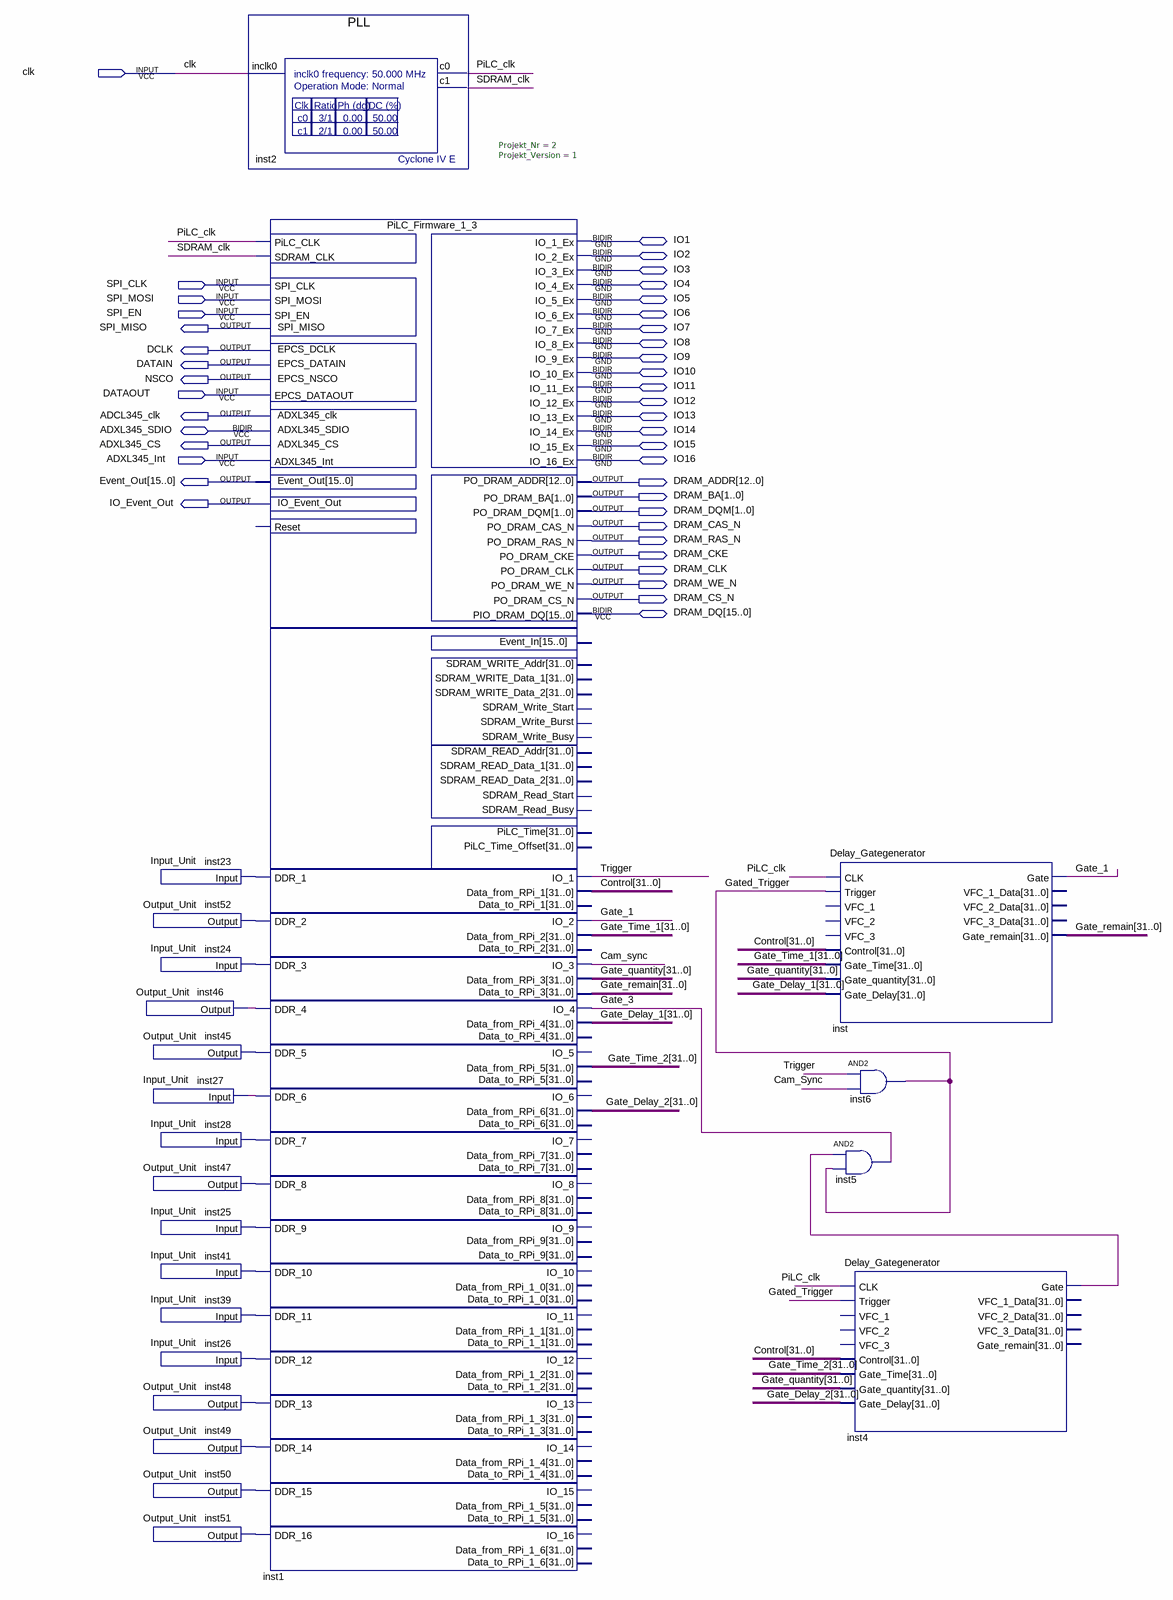
[diagram p0: schematic sheet]
// Quartus schematic PILC.bdf as structural Verilog: 22 symbols, 41 pins
module PILC (
  input  clk,
  input  SPI_CLK,
  input  SPI_MOSI,
  input  SPI_EN,
  input  DATAOUT,
  input  ADXL345_Int,
  inout  IO1,
  inout  IO2,
  inout  IO3,
  inout  IO4,
  inout  IO5,
  inout  IO6,
  inout  IO7,
  inout  IO8,
  inout  IO9,
  inout  IO10,
  inout  IO11,
  inout  IO12,
  inout  IO13,
  inout  ADXL345_SDIO,
  inout  IO14,
  inout  IO15,
  inout  IO16,
  inout  [15:0] DRAM_DQ,
  output SPI_MISO,
  output DCLK,
  output DATAIN,
  output NSCO,
  output ADCL345_clk,
  output ADXL345_CS,
  output [15:0] Event_Out,
  output [12:0] DRAM_ADDR,
  output [1:0] DRAM_BA,
  output IO_Event_Out,
  output [1:0] DRAM_DQM,
  output DRAM_CAS_N,
  output DRAM_RAS_N,
  output DRAM_CKE,
  output DRAM_CLK,
  output DRAM_WE_N,
  output DRAM_CS_N
);

  wire Cam_sync, Gate_1, Gate_3, Gated_Trigger, inst4_gate, inst23_input, inst24_input, inst25_input,
       inst26_input, inst27_input, inst28_input, inst39_input, inst41_input, inst45_output, inst46_output,
       inst47_output, inst48_output, inst49_output, inst50_output, inst51_output, inst52_output, PiLC_clk,
       SDRAM_clk, Trigger;
  wire [31:0] Control, Gate_Delay_1, Gate_Delay_2, Gate_quantity, Gate_remain, Gate_Time_1, Gate_Time_2;

  Input_Unit inst23 (.Input(inst23_input));
  Output_Unit inst52 (.Output(inst52_output));
  Input_Unit inst24 (.Input(inst24_input));
  Output_Unit inst46 (.Output(inst46_output));
  Output_Unit inst45 (.Output(inst45_output));
  Input_Unit inst27 (.Input(inst27_input));
  Input_Unit inst28 (.Input(inst28_input));
  Output_Unit inst47 (.Output(inst47_output));
  Input_Unit inst25 (.Input(inst25_input));
  Input_Unit inst41 (.Input(inst41_input));
  Input_Unit inst39 (.Input(inst39_input));
  Input_Unit inst26 (.Input(inst26_input));
  Output_Unit inst48 (.Output(inst48_output));
  Output_Unit inst49 (.Output(inst49_output));
  Output_Unit inst50 (.Output(inst50_output));
  Output_Unit inst51 (.Output(inst51_output));
  PLL inst2 (.inclk0(clk), .c0(PiLC_clk), .c1(SDRAM_clk));
  PiLC_Firmware_1_3 #(.Projekt_Nr(2), .Projekt_Version(1)) inst1 (
    .PiLC_CLK(PiLC_clk), .SDRAM_CLK(SDRAM_clk), .SPI_CLK(SPI_CLK), .SPI_MOSI(SPI_MOSI), .SPI_EN(SPI_EN),
    .EPCS_DATAOUT(DATAOUT), .DDR_1(inst23_input), .DDR_2(inst52_output), .DDR_3(inst24_input),
    .Data_to_RPi_3(Gate_remain), .DDR_4(inst46_output), .DDR_5(inst45_output), .DDR_6(inst27_input),
    .DDR_7(inst28_input), .DDR_8(inst47_output), .DDR_9(inst25_input), .DDR_10(inst41_input),
    .DDR_11(inst39_input), .DDR_12(inst26_input), .DDR_13(inst48_output), .DDR_14(inst49_output),
    .DDR_15(inst50_output), .DDR_16(inst51_output), .ADXL345_Int(ADXL345_Int), .SPI_MISO(SPI_MISO),
    .EPCS_DCLK(DCLK), .EPCS_DATAIN(DATAIN), .EPCS_NSCO(NSCO), .IO_Event_Out(IO_Event_Out),
    .Event_Out(Event_Out), .Data_from_RPi_1(Control), .Data_from_RPi_2(Gate_Time_1),
    .Data_from_RPi_3(Gate_quantity), .Data_from_RPi_4(Gate_Delay_1), .Data_from_RPi_5(Gate_Time_2),
    .Data_from_RPi_6(Gate_Delay_2), .PO_DRAM_ADDR(DRAM_ADDR), .PO_DRAM_BA(DRAM_BA), .PO_DRAM_DQM(DRAM_DQM),
    .PO_DRAM_CAS_N(DRAM_CAS_N), .PO_DRAM_RAS_N(DRAM_RAS_N), .PO_DRAM_CKE(DRAM_CKE), .PO_DRAM_CLK(DRAM_CLK),
    .PO_DRAM_WE_N(DRAM_WE_N), .PO_DRAM_CS_N(DRAM_CS_N), .ADXL345_CS(ADXL345_CS), .IO_1_Ex(IO1),
    .IO_2_Ex(IO2), .IO_3_Ex(IO3), .IO_4_Ex(IO4), .IO_5_Ex(IO5), .IO_6_Ex(IO6), .IO_7_Ex(IO7), .IO_8_Ex(IO8),
    .IO_9_Ex(IO9), .IO_10_Ex(IO10), .IO_11_Ex(IO11), .IO_12_Ex(IO12), .IO_13_Ex(IO13), .IO_14_Ex(IO14),
    .IO_15_Ex(IO15), .IO_16_Ex(IO16), .IO_1(Trigger), .IO_2(Gate_1), .IO_3(Cam_sync), .IO_4(Gate_3),
    .PIO_DRAM_DQ(DRAM_DQ), .ADXL345_clk(ADCL345_clk), .ADXL345_SDIO(ADXL345_SDIO));  // open: Event_In, Data_to_RPi_1, Data_to_RPi_2, Data_to_RPi_4, Data_to_RPi_5, Data_to_RPi_6, Data_to_RPi_7, Data_to_RPi_8, Data_to_RPi_9, Data_to_RPi_1_0, Data_to_RPi_1_1, Data_to_RPi_1_2, Data_to_RPi_1_3, Data_to_RPi_1_4, Data_to_RPi_1_5, Data_to_RPi_1_6, SDRAM_WRITE_Addr, SDRAM_WRITE_Data_1, SDRAM_WRITE_Data_2, SDRAM_READ_Addr, SDRAM_Write_Start, SDRAM_Write_Burst, SDRAM_Read_Start, Reset, PiLC_Time, PiLC_Time_Offset, Data_from_RPi_7, Data_from_RPi_8, Data_from_RPi_9, Data_from_RPi_1_0, Data_from_RPi_1_1, Data_from_RPi_1_2, Data_from_RPi_1_3, Data_from_RPi_1_4, Data_from_RPi_1_5, Data_from_RPi_1_6, SDRAM_READ_Data_1, SDRAM_READ_Data_2, SDRAM_Write_Busy, SDRAM_Read_Busy, IO_5, IO_6, IO_7, IO_8, IO_9, IO_10, IO_11, IO_12, IO_13, IO_14, IO_15, IO_16
  Delay_Gategenerator inst (
    .CLK(PiLC_clk), .Trigger(Gated_Trigger), .Control(Control), .Gate_Time(Gate_Time_1),
    .Gate_quantity(Gate_quantity), .Gate_Delay(Gate_Delay_1), .Gate(Gate_1), .Gate_remain(Gate_remain));  // open: VFC_1, VFC_2, VFC_3, VFC_1_Data, VFC_2_Data, VFC_3_Data
  and inst6 (Gated_Trigger, Trigger, Cam_sync);
  and inst5 (Gate_3, inst4_gate, Gated_Trigger);
  Delay_Gategenerator inst4 (
    .CLK(PiLC_clk), .Trigger(Gated_Trigger), .Control(Control), .Gate_Time(Gate_Time_2),
    .Gate_quantity(Gate_quantity), .Gate_Delay(Gate_Delay_2), .Gate(inst4_gate));  // open: VFC_1, VFC_2, VFC_3, VFC_1_Data, VFC_2_Data, VFC_3_Data, Gate_remain
endmodule
